# EAGLE board motor_board_tmc (EAGLE 9.6.2)
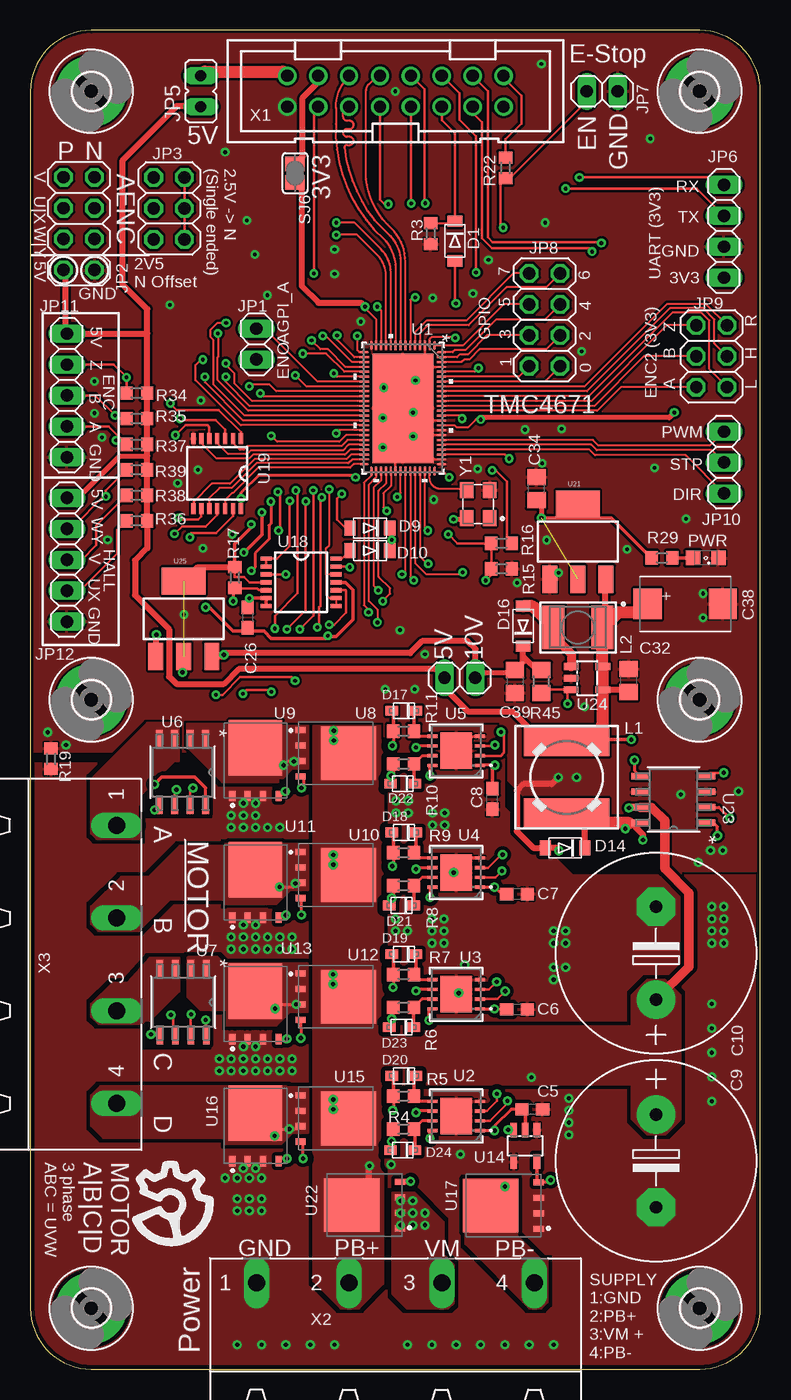
[diagram p3: board, top side]
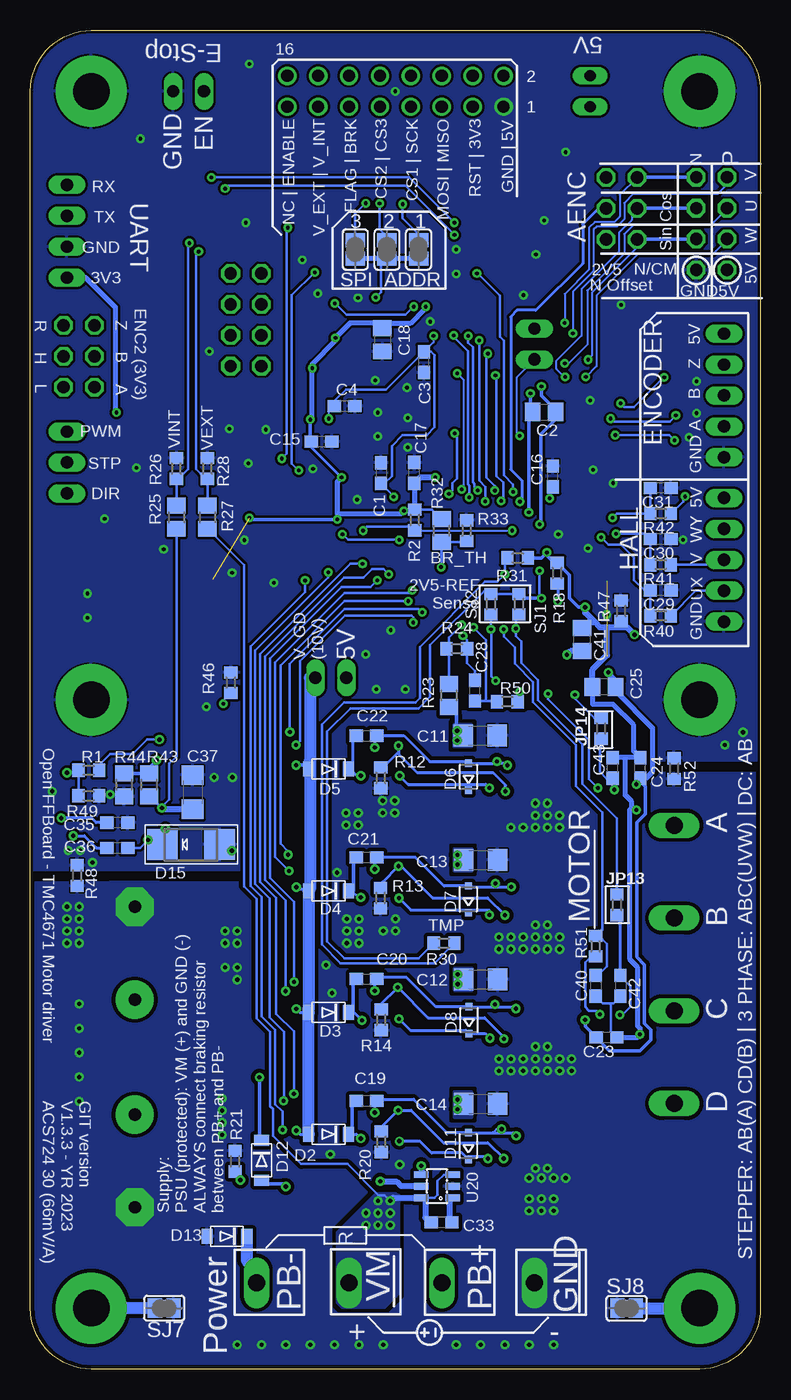
[diagram p4: board, bottom side, seen from below]

Size 60 x 110 mm. Coordinates in mm from the lower left corner, seen from the top.
Outline: 0,5 arc90 5,0 55,0 arc90 60,5 60,105 arc90 55,110 5,110 arc90 0,105 0,5
Copper layers (1*16): Top 0.07mm / dielectric 1.5mm / Bottom 0.07mm
Design rules "jlcpcb *": minimum track width 5mil, minimum drill 0.3mm, track to track 8mil, track to pad 8mil, pad to pad 8mil, via to via 8mil, smd to smd 5mil, copper to edge 0.2mm, drill to drill 8mil, minimum pad ring 10mil, minimum via ring 8mil, stop-mask expansion 4mil, vias tented up to drill 0.4mm, thermal gap 6mil

## Footprints (pad centres in the part's own frame; a part is rotated, then mirrored left to right if it is on the bottom)
C0603 = smd 1.1 x 1: 1 -0.85,0; 2 0.85,0
C0805 = smd 1.3 x 1.5: 1 -0.95,0; 2 0.95,0
E7,5-16 = drill 1.016 pad 3.15: + -3.81,0 | drill 1.016 pad 3.15 octagon: - 3.81,0
C1206 = smd 1.6 x 1.8: 1 -1.4,0; 2 1.4,0
CAPPM7343X310N = smd 2.31 x 2.52: 1 -3.1,0; 2 3.1,0
SOD-123FL = smd 0.91 x 1.22: A 1.637,0; C -1.637,0
SOD323-R = smd 0.6 x 0.6: A 1.1,0; C -1.1,0
SMADIODE = smd 2.54 x 2.54: A 2.349,0; C -2.349,0
SOD-323F = smd 1 x 0.8: A -1,0; C 1,0
3,0-PAD = drill 3 pad 5.842: B3,0 0,0
1X02 = drill 1.016 long: 1 -1.27,0; 2 1.27,0
2X04 = drill 1.016 octagon: 1 -3.81,-1.27; 2 -3.81,1.27; 3 -1.27,-1.27; 4 -1.27,1.27; 5 1.27,-1.27; 6 1.27,1.27; 7 3.81,-1.27; 8 3.81,1.27
2X03 = drill 1.016 octagon: 1 -2.54,-1.27; 2 -2.54,1.27; 3 0,-1.27; 4 0,1.27; 5 2.54,-1.27; 6 2.54,1.27
JP1 = drill 0.914 long: 1 0,-1.27; 2 0,1.27
1X04 = drill 1.016 long: 1 -3.81,0; 2 -1.27,0; 3 1.27,0; 4 3.81,0
1X03 = drill 1.016 long: 1 -2.54,0; 2 0,0; 3 2.54,0
1X05 = drill 1.016 long: 1 -5.08,0; 2 -2.54,0; 3 0,0; 4 2.54,0; 5 5.08,0
RESISTOR_R0603 = smd 1 x 1.1: 1 -0.85,0; 2 0.85,0
8MMINDUCTOR = smd 2.5 x 7: 1 -3,0; 2 3,0
L4532P = smd 1.8 x 3.6: 1 -2,0; 2 2,0
SML0805 = smd 1.2 x 1.2: A 1.05,0; C -1.05,0
R0603 = smd 1 x 1.1: 1 -0.85,0; 2 0.85,0
R0805 = smd 1.3 x 1.5: 1 -0.95,0; 2 0.95,0
SJ = smd 1.168 x 1.6: 1 -0.762,0; 2 0.762,0
QFN76_10P5X6P5 = smd 0.152 x 0.755: 1 -2.6,-5.173; 2 -2.2,-5.173; 3 -1.8,-5.173; 4 -1.4,-5.173; 5 -1,-5.173; 6 -0.6,-5.173; 7 -0.2,-5.173; 8 0.2,-5.173; 9 0.6,-5.173; 10 1,-5.173; 11 1.4,-5.173; 12 1.8,-5.173; 13 2.2,-5.173; 14 2.6,-5.173; 39 2.6,5.173; 40 2.2,5.173; 41 1.8,5.173; 42 1.4,5.173; 43 1,5.173; 44 0.6,5.173; 45 0.2,5.173; 46 -0.2,5.173; 47 -0.6,5.173; 48 -1,5.173; 49 -1.4,5.173; 50 -1.8,5.173; 51 -2.2,5.173; 52 -2.6,5.173 | smd 0.755 x 0.152: 15 3.179,-4.6; 16 3.179,-4.2; 17 3.179,-3.8; 18 3.179,-3.4; 19 3.179,-3; 20 3.179,-2.6; 21 3.179,-2.2; 22 3.179,-1.8; 23 3.179,-1.4; 24 3.179,-1; 25 3.179,-0.6; 26 3.179,-0.2; 27 3.179,0.2; 28 3.179,0.6; 29 3.179,1; 30 3.179,1.4; 31 3.179,1.8; 32 3.179,2.2; 33 3.179,2.6; 34 3.179,3; 35 3.179,3.4; 36 3.179,3.8; 37 3.179,4.2; 38 3.179,4.6; 53 -3.179,4.6; 54 -3.179,4.2; 55 -3.179,3.8; 56 -3.179,3.4; 57 -3.179,3; 58 -3.179,2.6; 59 -3.179,2.2; 60 -3.179,1.8; 61 -3.179,1.4; 62 -3.179,1; 63 -3.179,0.6; 64 -3.179,0.2; 65 -3.179,-0.2; 66 -3.179,-0.6; 67 -3.179,-1; 68 -3.179,-1.4; 69 -3.179,-1.8; 70 -3.179,-2.2; 71 -3.179,-2.6; 72 -3.179,-3; 73 -3.179,-3.4; 74 -3.179,-3.8; 75 -3.179,-4.2; 76 -3.179,-4.6 | smd 5.004 x 8.992: 77 0,0
SDC08A = smd 0.254 x 0.813: 1 -1.2,-1.943; 2 -0.4,-1.943; 3 0.4,-1.943; 4 1.2,-1.943; 5 1.2,1.943; 6 0.4,1.943; 7 -0.4,1.943; 8 -1.2,1.943 | smd 2.997 x 2.591: 9 0,0
SOIC8_D_TEX = smd 1.46 x 0.559: 1 -2.724,1.905; 2 -2.724,0.635; 3 -2.724,-0.635; 4 -2.724,-1.905; 5 2.724,-1.905; 6 2.724,-0.635; 7 2.724,0.635; 8 2.724,1.905
MOSFET_BSC093N04LSGATMA1 = smd 0.5 x 0.85: 1 -1.905,-2.9; 2 -0.635,-2.9; 3 0.635,-2.9; 4 1.905,-2.9 | smd 4.41 x 4.55: 5 0,1.05
SOT23-5L = smd 0.55 x 1.2: 1 -0.95,-1.3; 2 0,-1.3; 3 0.95,-1.3; 4 0.95,1.3; 5 -0.95,1.3
TSSOP14 = smd 0.9 x 0.35: 1 -2.875,1.95; 2 -2.875,1.3; 3 -2.875,0.65; 4 -2.875,0; 5 -2.875,-0.65; 6 -2.875,-1.3; 7 -2.875,-1.95; 8 2.875,-1.95; 9 2.875,-1.3; 10 2.875,-0.65; 11 2.875,0; 12 2.875,0.65; 13 2.875,1.3; 14 2.875,1.95
SOT23-6 = smd 0.55 x 1.2: 1 -0.95,-1.3; 2 0,-1.3; 3 0.95,-1.3; 4 0.95,1.3; 5 0,1.3; 6 -0.95,1.3
SOT223 = smd 1.219 x 2.235: 1 -2.311,-3.099; 2 0,-3.099; 3 2.311,-3.099 | smd 3.6 x 2.2: 4 0,3.099
21-0041B_8_MXM = smd 0.543 x 1.455: 1 -1.905,-2.721; 2 -0.635,-2.721; 3 0.635,-2.721; 4 1.905,-2.721; 5 1.905,2.721; 6 0.635,2.721; 7 -0.635,2.721; 8 -1.905,2.721
PAK100/2500-16 = drill 1 pad 1.422: 1 -8.89,-1.27; 2 -8.89,1.27; 3 -6.35,-1.27; 4 -6.35,1.27; 5 -3.81,-1.27; 6 -3.81,1.27; 7 -1.27,-1.27; 8 -1.27,1.27; 9 1.27,-1.27; 10 1.27,1.27; 11 3.81,-1.27; 12 3.81,1.27; 13 6.35,-1.27; 14 6.35,1.27; 15 8.89,-1.27; 16 8.89,1.27
GMSTBA4 = drill 1.397 long: 1 -11.43,5.08; 2 -3.81,5.08; 3 3.81,5.08; 4 11.43,5.08
ECS-327KE-TR = smd 1.3 x 1.1: 1 -1.15,-0.95; 2 1.15,-0.95; 3 1.15,0.95; 4 -1.15,0.95

## Placement (x,y rotation side)
C1  100nF  [C0603]  31.18,73.62 270 bottom
C2  10µF  [C0805]  17.77,78.65 0 bottom
C3  100nF  [C0603]  27.65,82.75 90 bottom
C4  100nF  [C0603]  34.17,79.12 180 bottom
C5  100nF  [C0603]  41.25,21.35 180 top
C6  100nF  [C0603]  40,29.55 180 top
C7  100nF  [C0603]  40,39.03 180 top
C8  100nF  [C0603]  37.98,46.85 90 top
C9  680µF  [E7,5-16]  51.42,17.1 270 top
C10  680µF  [E7,5-16]  51.42,34.17 90 top
C11  1µF  [C1206]  23.02,52.05 0 bottom
C12  1µF  [C1206]  22.98,32.03 0 bottom
C13  1µF  [C1206]  23,41.85 0 bottom
C14  1µF  [C1206]  23,21.8 0 bottom
C15  100nF  [C0603]  36.08,76.22 0 bottom
C16  100nF  [C0603]  17.05,73.35 90 bottom
C17  100nF  [C0603]  28.45,73.65 90 bottom
C18  10µF  [C0805]  31.07,84.58 270 bottom
C19  100nF  [C0603]  32.38,22.05 0 bottom
C20  100nF  [C0603]  32.38,32.05 0 bottom
C21  100nF  [C0603]  32.38,42.05 0 bottom
C22  100nF  [C0603]  32.38,52.05 0 bottom
C23  100nF  [C0603]  12.65,27.25 180 bottom
C24  100nF  [C0603]  9.88,49.4 90 bottom
C25  10µF  [C0805]  12.85,56.05 180 bottom
C26  100nF  [C0603]  17.85,61.75 270 top
C28  4.7nF  [C0603]  23.45,55.75 90 bottom
C29  4.7nF  [C0603]  8.2,64 180 bottom
C30  4.7nF  [C0603]  8.2,68.2 180 bottom
C31  4.7nF  [C0603]  8.2,72.4 180 bottom
C32  10µF  [C0805]  49.17,56.58 90 top
C33  100nF  [C0603]  26.2,12.05 180 bottom
C34  10µF  [C0805]  41.6,72.35 90 top
C35  100nF  [C0603]  52.85,44.9 180 bottom
C36  100nF  [C0603]  52.85,42.83 0 bottom
C37  1µF  [C1206]  46.67,47.4 270 bottom
C38  593D476X0016D2TE3  [CAPPM7343X310N]  53.83,62.88 0 top
C39  10µF  [C0805]  39.83,56.5 270 top
C40  4.7nF  [C0603]  13.55,31.5 270 bottom
C41  10µF  [C0805]  14.65,59.95 90 bottom
C42  100nF  [C0603]  11.5,31.5 270 bottom
C43  100nF  [C0603]  12.15,49.4 90 bottom
D1  LV low drop  [SOD-123FL]  34.9,92.7 270 top
D2  HV >100V  [SOD-123FL]  35.5,19.3 180 bottom
D3  HV >100V  [SOD-123FL]  35.5,29.3 180 bottom
D4  HV >100V  [SOD-123FL]  35.5,39.3 180 bottom
D5  HV >100V  [SOD-123FL]  35.5,49.3 180 bottom
D6  BZX384-XXX  [SOD323-R]  24,48.67 90 bottom
D7  BZX384-XXX  [SOD323-R]  24,38.6 90 bottom
D8  BZX384-XXX  [SOD323-R]  23.95,28.67 90 bottom
D9  LV low drop  [SOD-123FL]  27.9,69.1 180 top
D10  LV low drop  [SOD-123FL]  27.9,67.25 180 top
D11  BZX384-XXX  [SOD323-R]  24,18.33 90 bottom
D12  HV >100V  [SOD-123FL]  41,17.15 270 bottom
D13  Zener 65V (MMSZ5265BT1G)  [SOD-123FL]  43.85,10.9 180 bottom
D14  HV >100V  [SOD-123FL]  43.95,42.83 180 top
D15  HV >100V  [SMADIODE]  46.8,43.1 0 bottom
D16  LV low drop  [SOD-123FL]  40.5,61.05 90 top
D17  [SOD-323F]  30.7,54.1 0 top
D18  [SOD-323F]  30.7,44.1 0 top
D19  [SOD-323F]  30.7,34.1 0 top
D20  [SOD-323F]  30.7,24.1 0 top
D21  [SOD-323F]  30.5,38.1 0 top
D22  [SOD-323F]  30.6,48.1 0 top
D23  [SOD-323F]  30.5,28.1 0 top
D24  [SOD-323F]  30.6,18 0 top
H1  MOUNT-PAD-ROUND3.0  [3,0-PAD]  55,5 0 top
H2  MOUNT-PAD-ROUND3.0  [3,0-PAD]  5,5 0 top
H3  MOUNT-PAD-ROUND3.0  [3,0-PAD]  55,105 0 top
H4  MOUNT-PAD-ROUND3.0  [3,0-PAD]  55,55 0 top
H5  MOUNT-PAD-ROUND3.0  [3,0-PAD]  5,105 0 top
H6  MOUNT-PAD-ROUND3.0  [3,0-PAD]  5,55 0 top
JP1  [1X02]  18.57,84.22 90 top
JP2  [2X04]  4,94.12 90 top
JP3  [2X03]  11.4,95.38 270 top
JP4  V_DRV  [1X02]  35.3,56.8 180 top
JP5  [JP1]  14,105 0 top
JP6  [1X04]  57,93.5 270 top
JP7  [1X02]  47,105 180 top
JP8  [2X04]  42.27,86.22 90 top
JP9  [2X03]  56,83.22 90 top
JP10  [1X03]  57,74.5 270 top
JP11  [1X05]  3,80 270 top
JP12  [1X05]  3,66.5 270 top
JP13  JUMPER-SMT_2_NO_SILK  [RESISTOR_R0603]  11.8,38.15 90 bottom
JP14  JUMPER-SMT_2_NO_SILK  [RESISTOR_R0603]  13.1,52.65 90 bottom
L1  220µH  [8MMINDUCTOR]  44.08,48.62 90 top
L2  10µH  [L4532P]  45,60.95 180 top
LED1  Green  [SML0805]  55.5,66.65 180 top
R1  47k  [R0603]  55.2,49.2 0 bottom
R2  10k  [R0603]  28.4,69.78 90 bottom
R3  10k  [R0603]  32.9,93.3 90 top
R4  10  [R0603]  30.68,19.72 0 top
R5  10  [R0603]  30.68,22.42 0 top
R6  10  [R0603]  30.68,29.72 0 top
R7  10  [R0603]  30.68,32.42 0 top
R8  10  [R0603]  30.68,39.72 0 top
R9  10  [R0603]  30.68,42.42 0 top
R10  10  [R0603]  30.68,49.73 0 top
R11  10  [R0603]  30.68,52.42 0 top
R12  36k  [R0603]  31.2,48.58 90 bottom
R13  36k  [R0603]  31.23,38.7 90 bottom
R14  36k  [R0603]  31.18,28.7 90 bottom
R15  10k  [R0603]  38.73,65.75 180 top
R16  1.5k  [R0603]  38.73,67.85 180 top
R17  10k  [R0603]  16.8,65.05 90 top
R18  10k  [R0603]  16.7,65.4 270 bottom
R19  0  [R0603]  1.7,50.15 270 top
R20  36k  [R0603]  31.15,18.67 90 bottom
R21  36k  [R0603]  43.17,17.08 270 bottom
R22  1.5k  [R0603]  39.05,98.7 90 top
R23  71.5k  [R0805]  25.6,55.35 270 bottom
R24  1.5k  [R0603]  24.95,59.2 180 bottom
R25  294k  [R0805]  48,70 270 bottom
R26  10k  [R0603]  48,74 270 bottom
R27  294k  [R0805]  45.45,70 270 bottom
R28  10k  [R0603]  45.45,74 270 bottom
R29  1.5k  [R0603]  51.9,66.65 180 top
R30  10k thermistor  [R0603]  26,35 180 bottom
R31  1.5k  [R0603]  19.95,66.65 180 bottom
R32  71.5k  [R0805]  26.2,68.9 90 bottom
R33  47k  [R0603]  24.15,68.9 270 bottom
R34  4.7k  [R0603]  8.75,80.2 0 top
R35  4.7k  [R0603]  8.75,78.1 0 top
R36  4.7k  [R0603]  8.75,69.7 0 top
R37  4.7k  [R0603]  8.75,76 0 top
R38  4.7k  [R0603]  8.75,71.8 0 top
R39  4.7k  [R0603]  8.75,73.9 0 top
R40  1.5k  [R0603]  8.2,61.9 0 bottom
R41  1.5k  [R0603]  8.2,66.1 0 bottom
R42  1.5k  [R0603]  8.2,70.3 0 bottom
R43  294k  [R0805]  50.25,48 270 bottom
R44  71.5k  [R0805]  52.3,48 270 bottom
R45  71.5k  [R0805]  42,56.5 90 top
R46  10k  [R0603]  43.52,56.4 270 bottom
R47  0  [R0603]  11.45,62.3 90 bottom
R48  0  [R0603]  56.15,40.55 270 bottom
R49  15k  [R0603]  55.2,47.1 180 bottom
R50  1.5k  [R0603]  20.8,54.85 0 bottom
R51  1.5k  [R0603]  13.55,34.75 270 bottom
R52  0  [R0603]  7.1,49.35 270 bottom
SJ1  0R  [RESISTOR_R0603]  22.15,62.85 270 bottom
SJ2  0R  [RESISTOR_R0603]  19.85,62.85 270 bottom
SJ3  [SJ]  28.1,92 270 bottom
SJ4  [SJ]  30.7,92 270 bottom
SJ5  [SJ]  33.3,92 270 bottom
SJ6  3.3V  [SJ]  21.75,98.28 270 top
SJ7  [SJ]  49,5 180 bottom
SJ8  [SJ]  11,5 0 bottom
U1  TMC4671  [QFN76_10P5X6P5]  30.62,78.95 180 top
U2  LM5109BSD  [SDC08A]  35,20.8 90 top
U3  LM5109BSD  [SDC08A]  35,30.8 90 top
U4  LM5109BSD  [SDC08A]  35,40.8 90 top
U5  LM5109BSD  [SDC08A]  35,50.8 90 top
U6  TMCS1100  [SOIC8_D_TEX]  12.5,49.05 270 top
U7  TMCS1100  [SOIC8_D_TEX]  12.55,30.15 270 top
U8  BSC030N08NS5ATMA1  [MOSFET_BSC093N04LSGATMA1]  25.1,50.6 270 top
U9  BSC030N08NS5ATMA1  [MOSFET_BSC093N04LSGATMA1]  18.5,50 0 top
U10  BSC030N08NS5ATMA1  [MOSFET_BSC093N04LSGATMA1]  25.1,40.6 270 top
U11  BSC030N08NS5ATMA1  [MOSFET_BSC093N04LSGATMA1]  18.5,40 0 top
U12  BSC030N08NS5ATMA1  [MOSFET_BSC093N04LSGATMA1]  25.1,30.6 270 top
U13  BSC030N08NS5ATMA1  [MOSFET_BSC093N04LSGATMA1]  18.5,30 0 top
U14  MCP14XX  [SOT23-5L]  40.67,18.35 180 top
U15  BSC030N08NS5ATMA1  [MOSFET_BSC093N04LSGATMA1]  25.1,20.6 270 top
U16  BSC030N08NS5ATMA1  [MOSFET_BSC093N04LSGATMA1]  18.5,20 0 top
U17  BSC030N08NS5ATMA1  [MOSFET_BSC093N04LSGATMA1]  38.88,13.42 90 top
U18  MCP6004  [TSSOP14]  22.25,64.65 0 top
U19  74LV17APWJ  [TSSOP14]  15.35,73.6 270 top
U20  LM74700-Q1  [SOT23-6]  26.57,15.03 90 bottom
U21  [SOT223]  45,68 0 top
U22  BSC030N08NS5ATMA1  [MOSFET_BSC093N04LSGATMA1]  27.48,13.47 90 top
U23  MAX5033BASA+T  [21-0041B_8_MXM]  52.85,46.8 90 top
U24  AP3012KTR-G1  [SOT23-5L]  45.75,56.77 270 top
U25  [SOT223]  12.6,61.65 0 top
X1  2516-  [PAK100/2500-16]  30,105 0 top
X2  GMSTBA4  [GMSTBA4]  30,2 0 top
X3  GMSTBA4  [GMSTBA4]  2,33.25 270 top
Y1  25MHz  [ECS-327KE-TR]  36.8,71.08 90 top

## Tracks (layer width: path | path; a pad name or v marks a point on that pad's centre or on a via)
2.5V_REF  (via drill 0.3)
  Top 0.2: JP3.2 JP3.4 JP3.6
  Top 0.254: v18.15,65.6 18.47,65.92 18.47,67.05 19.62,68.19 19.62,69.33 19.77,69.48 v19.77,71.28
  Top 0.3: C26.1 17.85,63.2 v18,63.35
  Top 0.305: U18.7 U18.6 v18,63.35
  Bottom 0.2: 19.85,63.35 SJ2.1 SJ1.1 22.36,63.91 22.72,63.91 27.15,59.48 27.15,55.25 28.1,54.3 33.7,54.3 35.6,52.4 35.6,35.15 34.2,33.75 28.1,33.75 R30.2 | v18.15,65.6 18.15,63.5 v18,63.35
  Bottom 0.254: JP3.4 12.82,95.53 13.16,95.53 14.61,94.08 14.61,90.85 18.46,87 20,87 20.52,86.48 20.52,73.92 19.62,73.01 19.62,71.43 v19.77,71.28
  Bottom 0.305: 19.85,63.35 v18,63.35
2.5V_REF_A  (via drill 0.3)
  Top 0.152: U1.17 26.44,82.75 24.29,84.9 v24.02,84.9
  Top 0.2: v23.24,72.2 23.29,72.15 23.29,61.94 v22.15,60.8 | v15.25,55.4 15.79,55.4 17.25,56.86 21.45,56.86 v21.75,56.56
  Bottom 0.2: v24.02,84.9 24.02,84.34 23.64,83.96 23.64,72.89 23.49,72.74 23.49,72.46 v23.24,72.2 | SJ1.2 v22.15,60.8 22.09,60.74 22.09,56.9 v21.75,56.56 | v15.25,55.4 15.25,55.1 13.65,53.5 JP14.2
2.5V_REF_C  (via drill 0.3)
  Top 0.152: U1.19 25.8,81.95 24.3,83.44 v22.4,83.44
  Top 0.2: v21.82,72.19 21.97,72.05 21.97,63.77 20.1,61.9 v20.1,60.85
  Bottom 0.2: v22.4,83.44 22.54,83.31 22.54,73.25 21.82,72.54 v21.82,72.19 | SJ2.2 20.1,61.75 v20.1,60.85 20.1,60.25 19.65,59.8 19.65,58 18.27,56.62 18.27,54.98 14.63,51.34 14.63,48.07 11.8,45.24 JP13.2
2.5V_REF_RAW  (via drill 0.35)
  Top 0.2: R17.1 16.85,64.15 18.62,64.15 18.77,64 U18.5
  Top 0.25: R17.1 16.65,64.05 v16.65,63.1
  Bottom 0.25: R18.2 16.65,64.5 v16.65,63.1
5V_SENSE  (via drill 0.3, 0.35)  (1 unrouted)
  Top 0.152: U1.23 20.2,80.35 19.65,80.9 18.15,80.9 v18,80.75
  Top 0.2: U18.4 18.02,64.65 17.57,65.1 16.8,65.1 R17.2 16.7,65.8
  Top 0.254: 14.4,47.75 14.4,47.74 U6.8 | v14.4,28.7 14.46,28.64 U7.8
  Top 0.3: 14.4,47.75 13.5,48.65 10.8,48.65 v10.2,48.05 | 13.25,64.75 U25.4 | R17.2 16.8,67.8 18.14,69.15 v18.14,69.41
  Top 0.5: U25.2 12.5,58.45 v12.5,57.25 | U25.4 13.75,65.9 R17.2
  Bottom 0.2: v18.14,69.41 18.03,69.29 | v10.2,48.05 10.2,48.23 C24.1
  Bottom 0.3: v14.4,28.7 14.4,28.15 C23.2 12.4,26.15 9.9,26.15 9,27.05 9,27.88 9.53,28.41 9.53,33.23 10.17,33.87 10.17,44.92 9.47,45.62 9.47,47.88 9.88,48.29 C24.1 | v18,80.75 18,79.97 16.82,78.8 C2.2 16.82,78.05 18.03,76.85 18.03,69.29
  Bottom 0.4: C24.1 9.43,48.55 8.85,49.12 8.85,52.65 11.9,55.7 C25.1 11.45,56.5
  Bottom 0.5: v12.5,57.25 12.5,57.1 11.9,56.5 C25.1
+3V3  (via drill 0.3)  (1 unrouted)
  Top 0.152: U1.52 33.25,73.75 33.95,73.75 v34.42,73.28 | U1.43 29.62,72.58 29.02,71.98 29.02,70.81 v29.3,70.53 | U1.13 28.42,86.28 27.5,87.19 v27.5,87.3 | v34.92,84.75 34.92,84.8 33,84.8 32.82,84.62 U1.2 | v36.83,82.25 36.52,81.95 U1.72 | v37,78.03 36.6,78.03 35.99,77.42 35,77.42 34.87,77.55 U1.61
  Top 0.2: v17.32,71.56 17.32,70.75 U19.14
  Top 0.254: v26.73,73.28 26.57,73.42 18.74,73.42 17.32,72 v17.32,71.56
  Top 0.3: v42,69.95 45,69.95 | R29.2 47.75,69.95 45,69.95 | U21.4 45,69.95
  Top 0.4: Y1.4 35.75,69.83 v34.77,69.83 | v52.92,78.6 52.5,78.17 37.15,78.17 v37,78.03 | C34.1 42,71 v42,69.95
  Top 0.5: v27.5,87.3 27.18,87.62 23.68,87.62 22.3,89 22.3,96.96 SJ6.2
  Bottom 0.2: v29.3,70.53 29.2,70.62 R2.2 26.98,70.62 R32.2 | C15.1 37,76.3 | v17.32,71.56 17.32,72.23 C16.1
  Bottom 0.254: v34.42,73.28 36.92,75.78 C15.1
  Bottom 0.3: v27.5,87.3 27.6,87.2 | 36.91,78.12 v37,78.03 37,76.3 | v42,69.95 41.88,69.83 v34.77,69.83
  Bottom 0.4: 34.77,70.28 v34.77,69.83 | 27.6,87.2 27.6,87.1 28.77,85.92 31.07,85.92 | 36.91,78.12 36.91,82.17 v36.83,82.25 36.83,82.6 34.92,84.5 v34.92,84.75 33.73,85.95 31.07,85.95 31.07,85.92 | C17.1 28.45,71 28.93,70.53 v29.3,70.53 29.55,70.28 34.77,70.28 | v52.92,78.6 53,78.67 53,87.22 55.47,89.69 JP6.4 | C18.1 31.07,85.92 | 34.77,70.28 34.77,72.92 v34.42,73.28
  Bottom 0.5: v26.73,73.28 27.98,73.28 C17.1
+5V  (via drill 0.35)
  Top 0.2: 47.21,61.16 L2.1
  Top 0.254: C38.1 50.02,62.17 50,62.17
  Top 0.3: v49.4,51.73 46.73,51.73 46.62,51.62
  Top 0.4: JP12.1 3.88,71.58 7.33,75.03 9.6,75.03
  Top 0.5: 9.6,85.1 9.58,85.08 JP11.1 2.88,85.2 2.88,90.17 JP2.2 | 9.6,85.1 R34.2 R35.2 R37.2 9.6,75.03 R39.2 R38.2 R36.2 9.6,67.45 8.6,66.45 8.6,63.6 11.4,60.8 11.4,56.9 12,56.3 15.9,56.3 17.11,57.51 33.32,57.51 JP4.2 34.33,56.5 34.33,55.67 35.95,54.05 39.6,54.05 42.02,51.62 L1.2 45.62,51.62 47,53 | 9.6,85.1 9.6,87.1 7.6,89.1 7.6,99.35 12.03,103.78 13.95,103.78 JP5.1 | 47,55.77 U24.4 48.98,55.83 C32.1 | 47,52 46.62,51.62 | U21.3 47.21,64.8 47.21,61.16
  Top 0.8: U24.5 47,57.77
  Top 1: C38.1 51.26,63.41 | U24.4 U24.5 | 47,55.77 47,53 47,52 | 47,57.77 L2.1 47.1,60.95 48.33,62.17 50,62.17 51,62.17 51,63
  Bottom 0.2: v49.4,51.73 50.4,51.73 51.58,50.55 53.45,50.55 54.2,49.8 54.2,49.35 R1.2
AENC_UX  (via drill 0.3)
  Top 0.15: 18.2,79.55 16.75,81 16.75,81.83 16.07,82.5 v16.07,82.65
  Top 0.152: U1.25 18.2,79.55
  Bottom 0.15: 14.22,88.62 14.22,84.17 15.75,82.65 v16.07,82.65
  Bottom 0.152: 10.41,94.05 11.19,93.27 11.19,91.66 14.22,88.62 | JP2.6 2.73,95.34
  Bottom 0.2: 10.41,94.05 4.02,94.05 2.73,95.34
AENC_UX_N  (via drill 0.3)
  Top 0.15: U1.26 18.02,79.15 16.05,81.12 v16.05,81.53
  Bottom 0.152: v16.05,81.53 16.1,81.53 16.75,82.17 16.75,82.87 14.7,84.92 14.7,88.72 11.61,91.81 11.61,93.39 10.58,94.43 10.58,94.93 JP3.3 10.11,95.39
  Bottom 0.3: JP2.5 10.11,95.39
AENC_VN  (via drill 0.3)
  Top 0.15: U1.27 17.91,78.75
  Top 0.152: 17.91,78.75 15.39,81.27 15.39,83.14 15.41,83.16 v15.41,85.11
  Bottom 0.152: 10.43,96.6 11.2,95.83 11.2,94.47 11.78,93.89 13.46,93.89 13.72,93.62 13.72,90.2 15.41,88.52 v15.41,85.11
  Bottom 0.2: 2.72,97.38 3.5,96.6 10.43,96.6 | JP2.8 2.72,97.92
  Bottom 0.3: 2.72,97.92 2.72,97.38
AENC_VN_N  (via drill 0.3)
  Top 0.15: U1.28 17.62,78.35 15.04,80.94
  Top 0.152: v16.08,85.96 15.36,85.96 14.78,85.37 14.78,84.84 15.04,84.58 15.04,80.94
  Bottom 0.152: v16.08,85.96 16.08,88.35 14.08,90.35 14.08,93.77 13.61,94.25 12.01,94.25 11.56,94.7 11.56,96.49 JP3.1 10.11,97.94
  Bottom 0.3: JP2.7 10.11,97.94
AENC_WY  (via drill 0.3)
  Top 0.15: U1.29 17.48,77.95 14.35,81.08 v14.35,81.53
  Bottom 0.152: 10.03,91.67 13.47,88.22 13.47,82.4 v14.35,81.53 | JP2.4 2.73,92.8
  Bottom 0.2: 10.03,91.67 3.85,91.67 2.73,92.8
AENC_WY_N  (via drill 0.3)
  Top 0.15: U1.30 17.28,77.55 13.57,81.26 13.57,82.5
  Top 0.152: 13.57,82.5 14.03,82.95 v14.17,82.95
  Bottom 0.152: v14.17,82.95 13.83,83.29 13.83,88.47 10.13,92.17 JP3.5 10.11,92.86
  Bottom 0.3: JP2.3 10.11,92.86
AGPI_A
  Top 0.152: U1.21 23.6,81.15 19.25,85.5 JP1.2
AGPI_B  (via drill 0.3)
  Top 0.152: U1.22 22.68,80.75 v21.78,81.65
  Top 0.2: U18.2 U18.1 20.27,66.6 21.32,67.64 v21.32,71.35
  Bottom 0.2: v21.78,81.65 21.68,81.55 21.68,73.4 21.12,72.84 21.12,71.55 v21.32,71.35
BRAKE_CTRL  (via drill 0.3, 0.35)
  Top 0.2: D10.C 29.69,67.4 v29.69,68.15 29.69,69.12 29.56,69.12 D9.C | v34.35,68.6 35.1,67.85 R16.2 R15.2 37.88,65.25 v37.42,64.8
  Top 0.254: U14.3 v39.27,19.65
  Bottom 0.2: v37.42,64.8 37.42,63.85 41.92,59.36 41.92,39.71 41,38.79 41,29 39.88,27.88 39.88,21.77 39.27,21.16 v39.27,19.65 | v34.35,68.6 33.9,68.15 v29.69,68.15
BRAKE_CTRL_EXT  (via drill 0.3)
  Top 0.2: X1.12 35.25,104.83 35.25,102.65 36.6,101.3 36.6,90.15 v36.62,90.12 | R16.1 39.17,68.25 39.17,72.92 38.25,73.85 v37.95,73.85
  Bottom 0.2: v36.62,90.12 38.52,88.23 38.52,74.42 v37.95,73.85
BRAKE_CTRL_TMC  (via drill 0.3)
  Top 0.152: U1.31 25.38,77.15 v25.12,76.9
  Top 0.2: v25.6,71.92 25.2,71.53 25.2,69.8 25.9,69.1 D9.A
  Bottom 0.2: v25.12,76.9 24.95,76.72 24.95,73.17 25.3,72.83 25.3,72.22 v25.6,71.92
BRAKE_GATE  (via drill 0.35)
  Top 0.254: v42.75,15.53 42.55,15.33 U17.4
  Top 0.3: U17.4 41.65,15.45 41.65,17.03 U14.5
  Bottom 0.2: R21.2 42.75,16.22 v42.75,15.53
BRAKE_RES_COMP
  Top 0.152: D10.A 25.61,66.6 U18.14
BRAKE_RES_TH  (via drill 0.3)
  Top 0.2: U18.13 26.2,65.95 v26.25,65.9
  Bottom 0.2: R33.2 24.25,67.95 R32.1 26.2,65.95 v26.25,65.9
C_HS_A  (via drill 0.3, 0.35)
  Top 0.152: U1.39 28.02,73.43 27.42,72.83 27.42,62.77 27.79,62.4 v27.79,62.2
  Top 0.2: U5.2 38.67,50.4 38.92,50.65 38.92,52.1 v38.67,52.35
  Bottom 0.2: v38.67,52.35 38.7,52.38 38.7,57.94 34.2,62.45 28.12,62.45 27.87,62.2 v27.79,62.2
C_HS_B  (via drill 0.3, 0.35)
  Top 0.152: U1.41 28.82,73.03 28.22,72.43 28.22,64.38 v28.6,64
  Top 0.2: U4.2 38.23,40.4 v38.75,40.92
  Bottom 0.2: v38.75,40.92 39.9,42.08 39.9,58.08 34.2,63.77 28.82,63.77 v28.6,64
C_HS_C  (via drill 0.3, 0.35)
  Top 0.152: U1.46 30.8,73.75 30.8,65.55 v30.55,65.3
  Top 0.2: U3.2 38.38,30.4 v39.02,31.05
  Bottom 0.2: v39.02,31.05 39.02,38.53 40.71,40.21 40.71,58.54 34.21,65.03 32.64,65.03 31.92,65.75 31,65.75 v30.55,65.3
C_HS_D  (via drill 0.3, 0.35)
  Top 0.152: v35.52,65.47 35.35,65.3 32.55,65.3 31.62,66.23 U1.48
  Top 0.2: U2.2 37.77,20.4 39.2,21.83 v39.2,22.05
  Bottom 0.2: v39.2,22.05 39.15,22.1 39.15,27.72 40.33,28.9 40.33,38.69 41.51,39.87 41.51,59.06 35.52,65.05 v35.52,65.47
C_LS_A  (via drill 0.3, 0.35)
  Top 0.152: U1.40 28.42,73.28 27.82,72.68 27.82,63.1 28.52,62.4 v28.52,61.35
  Top 0.2: U5.3 38.1,51.2 v38.17,51.27
  Bottom 0.2: v38.17,51.27 37.85,51.6 37.85,58.2 34.12,61.92 28.68,61.92 28.52,61.77 v28.52,61.35
C_LS_B  (via drill 0.3, 0.35)
  Top 0.152: U1.42 29.22,72.78 28.62,72.18 28.62,65.1 29.56,64.16 29.56,63.71 v28.95,63.11
  Top 0.2: U4.3 37.62,41.2 38.7,42.28 v38.83,42.28
  Bottom 0.2: v38.83,42.28 38.83,42.55 39.45,43.17 39.45,57.83 34.17,63.11 v28.95,63.11
C_LS_C  (via drill 0.3, 0.35)
  Top 0.152: U1.47 31.22,65.09 v31.5,64.81
  Top 0.2: U3.3 37.7,31.2 v38.33,31.83
  Bottom 0.2: v38.33,31.83 38.33,38.4 40.3,40.37 40.3,58.37 34.42,64.26 32.05,64.26 v31.5,64.81
C_LS_D  (via drill 0.3, 0.35)
  Top 0.152: U1.49 32,73.76 32,66.75 32.58,66.17 v32.7,66.17
  Top 0.2: v38.35,22.62 38.35,22.03 37.52,21.2 U2.3
  Bottom 0.2: v38.35,22.62 38.35,27.75 39.8,29.2 39.8,38.73 41.11,40.04 41.11,58.77 33.7,66.17 v32.7,66.17
CLK_25M
  Top 0.152: Y1.3 35.75,72.33 33.7,72.33 arc-90 32.82,73.21 U1.51
CS1  (via drill 0.3)
  Top 0.2: X1.7 28.73,96.09 29.1,95.72 v29.4,95.72
  Bottom 0.2: SJ3.1 28.1,93.26 29.4,94.56 v29.4,95.72
CS2  (via drill 0.3)
  Top 0.2: X1.9 31.27,95.81 v31.3,95.78
  Bottom 0.2: v31.3,95.78 31.3,93.68 30.7,93.08 SJ4.1
CS3  (via drill 0.3)
  Top 0.2: X1.10 32.38,105.17 32.38,95.78 32.42,95.78 v32.45,95.8
  Bottom 0.2: SJ5.1 33.3,94.95 v32.45,95.8
CS_TMC  (via drill 0.3)
  Top 0.152: 31.43,88.08 31.22,87.87 U1.6
  Top 0.2: v31.62,88.08 31.43,88.08
  Bottom 0.2: v31.62,88.08 31.2,88.5 31.2,90.74 SJ4.2
  Bottom 0.4: SJ3.2 SJ4.2 SJ5.2
DIR
  Top 0.152: JP10.3 53.86,75.1 46.4,75.1 45.95,75.55 U1.56
ENABLE  (via drill 0.3)
  Top 0.152: 39.02,75.15 U1.55
  Top 0.2: v39.35,74.82 39.02,75.15 | v38.85,93.79 38.62,94.02 38.62,97.42 R22.1 39.4,97.85 45.73,104.18 JP7.2
  Bottom 0.2: v38.85,93.79 38.95,93.69 38.95,75.22 v39.35,74.82
ENC2_A
  Top 0.152: JP9.2 48.53,80.69 46.59,78.75 U1.64
ENC2_B
  Top 0.152: JP9.4 50.43,83.22 46.35,79.15 U1.65
ENC2_Z
  Top 0.152: JP9.6 52.33,85.77 46.12,79.55 U1.66
ENC_A
  Top 0.152: U1.35 26.26,75.55 25.85,75.14 18.29,75.14 17.98,74.83 15.31,74.83 14.05,76.09 U19.6
ENC_A_5V  (via drill 0.3)
  Top 0.152: v7.05,76.33 7.58,76.33 R37.1
  Top 0.2: R37.1 6.44,77.46 JP11.4 | U19.5 14.7,77.41 14.55,77.56 12.77,77.56 11.95,76.75 v11.93,76.75
  Bottom 0.2: v7.05,76.33 7.47,76.75 v11.93,76.75
ENC_B
  Top 0.152: U1.34 26.16,75.95 25.7,75.49 18.1,75.49 17.8,75.19 16.25,75.19 15.35,76.09 U19.4
ENC_B_5V  (via drill 0.3)
  Top 0.2: R35.1 7.22,78.1 v6.95,78.38 5.33,80 JP11.3 | U19.3 16,77.18 15.21,77.97 12.3,77.97 v12.3,78.1
  Bottom 0.2: v6.95,78.38 7.45,77.88 12.07,77.88 v12.3,78.1
ENC_Z
  Top 0.152: U1.33 26.05,76.35 25.55,75.85 17.83,75.85 17.52,75.55 17.2,75.55 16.65,76.09 U19.2
ENC_Z_5V  (via drill 0.3)
  Top 0.2: JP11.2 6.86,82.54 v7.9,81.5 R34.1 | U19.1 17.3,77 15.48,78.82 12.03,78.82 v11.5,79.35
  Bottom 0.2: v11.5,79.35 11.2,79.05 10.4,79.05 7.92,81.53 v7.9,81.5
ENO  (via drill 0.3)
  Top 0.152: U1.32 25.95,76.75 25.41,76.21 20.28,76.21 v19.79,76.7
  Bottom 0.152: JP1.1 20.05,81.48 20.05,76.96 v19.79,76.7
FLAG
  Top 0.152: R3.2 34.85,94.15 34.9,94.2 D1.C
  Top 0.2: X1.11 33.81,102.63 34.9,101.54 D1.C
G_HS_A  (via drill 0.35)
  Top 0.254: v22.27,47.75 22.48,47.75 22.48,48.42 U8.4 | R10.1 29.82,48.92 v29.65,48.75
  Top 0.3: D22.A 29.6,48.7 v29.65,48.75
  Bottom 0.2: D6.C 24,48.05
  Bottom 0.254: v22.27,47.75 22.57,48.05 24,48.05 28.95,48.05 v29.65,48.75
G_HS_B  (via drill 0.35)
  Top 0.254: v22.27,37.33 22.27,38.62 U10.4 | R8.1 29.82,38.83 v29.7,38.7
  Top 0.3: D21.A 29.5,38.5 v29.7,38.7
  Bottom 0.2: D7.C 24,37.72
  Bottom 0.254: 24,37.72 22.27,37.72 v22.27,37.33 | v29.7,38.7 28.73,37.72 24.23,37.72 D7.C
G_HS_C  (via drill 0.35)
  Top 0.254: U12.4 22.2,28.1 22.23,28.08 v22.23,27.2 | v29.7,28.78 29.82,28.9 R6.1
  Top 0.3: D23.A 29.5,28.58 v29.7,28.78
  Bottom 0.254: v22.23,27.2 22.6,27.58 D8.C 24.23,27.85 28.77,27.85 v29.7,28.78
G_HS_D  (via drill 0.35)
  Top 0.254: v22.4,17.3 22.4,18.5 U15.4 | v29.68,18.72 29.68,19.58 R4.1
  Top 0.3: D24.A 29.68,18.08 v29.68,18.72
  Bottom 0.2: D11.C 24,17.47
  Bottom 0.254: 24,17.47 22.45,17.47 22.4,17.42 v22.4,17.3 | D11.C 24.52,17.75 27.02,17.75 28,18.72 v29.68,18.72
G_LS_A  (via drill 0.35)
  Top 0.254: U9.4 20.57,47.1 v20.95,47.48 | R11.1 29.82,51.3 v29.75,51.23
  Top 0.3: D17.A 29.82,53.98 R11.1
  Bottom 0.152: R12.2 31.02,49.42 30.73,49.73
  Bottom 0.254: v20.95,47.48 20.95,47.98 21.97,49.01 28.21,49.01 29.75,50.55 | v29.75,51.23 29.75,50.55 | 29.75,50.55 29.82,50.62 30.73,49.73
G_LS_B  (via drill 0.35)
  Top 0.254: U11.4 20.8,37.1 v21,37.3 | R9.1 29.82,41.4 v29.75,41.33
  Top 0.3: D18.A 29.82,43.97 R9.1
  Bottom 0.152: R13.2 31.04,39.74 31.04,40.04
  Bottom 0.254: v21,37.3 22.43,38.72 26.95,38.72 29.55,41.33 v29.75,41.33 31.04,40.04
G_LS_C  (via drill 0.35)
  Top 0.254: U13.4 20.43,27.12 v21.07,27.12 | R7.1 29.82,31.39 v29.8,31.37
  Top 0.3: D19.A 29.82,33.97 R7.1
  Bottom 0.152: R14.2 31.18,29.99
  Bottom 0.254: v21.07,27.12 21.07,27.28 22.68,28.88 27.31,28.88 v29.8,31.37 31.18,29.99
G_LS_D  (via drill 0.35)
  Top 0.254: v21.1,17.3 20.61,17.3 U16.4 | R5.1 29.82,21.32 v29.77,21.27
  Top 0.3: D20.A 29.82,23.97 R5.1
  Bottom 0.152: R20.2 31.15,19.89
  Bottom 0.254: v21.1,17.3 22.4,18.6 26.05,18.6 28.72,21.27 v29.77,21.27 31.15,19.89
GND  (via drill 0.3, 0.35)
  Top 0.152: 30.62,80 30.62,81.87 31.1,82.35 32.5,82.35 | 30.62,80 U1.77 | 30.62,80 30.57,79.95 29,79.95 30,78.95 U1.77 | U1.54 33.25,74.75 31.5,76.5 | 31.42,76.75 31.59,76.59 31.5,76.5 | 31.42,76.75 30.62,77.55 30.62,78 | 30.62,78 U1.77 | U1.62 32.55,77.95 32.5,78 30.62,78 | U1.73 32.5,82.35 | U1.3 32.42,82.43 32.5,82.35 | U1.44 30.02,74.98 30,75 31.5,76.5 | U1.59 31.42,76.75
  Top 0.5: v43.4,48.62 42.85,48.08 40.54,48.08 39.97,47.51 39.97,44.19 41.33,42.83 D14.A 43.23,42.83 v43.45,42.6
  other vias: 16,100 30,105 25,92 36.38,88.38 42.3,94.2 42,107.25 25,90 29.05,80.65 50.95,101.1 11.45,87.45 36.77,73.97 51.3,74.05 17.77,94.4 13.75,73.9 45.3,83.62 31.65,81.25 28.98,78.17 31.45,78.6 28.98,75.75 31.45,76.65 33.15,71.45 27.15,86.08 5.25,81.15 5.25,78.55 6.35,68.15 5.88,76.58 18.45,91.6 12.1,72.8 19.48,88.25 14.18,67.45 37.65,91.15 49.05,67.35 45.55,54.42 40,64.6 43.65,77.25 40.65,77.2 16.6,68.6 44.9,48.62 53.9,69.88 55.3,63.73 14,79.6 30.38,60.73 12.62,62 33.08,88.03 53.45,47.23 55.9,42.62 54.9,41.62 56.9,42.62 1.43,52.33 2.92,51.27 43.42,65.42 42.08,74.42 55.3,61.73 58.2,47.48 29.18,55.88 31.57,55.88 42.42,68.12 32.42,58.73
  pour Bottom (rank 6): -0.45,50 -0.45,111 60.3,111 60.3,41 42.2,41 42.2,50
  pour Top (rank 6): -0.6,50.67 -0.6,111 60.3,111 60.3,40.25 47.35,40.25 36.9,50.7
  pour Top (no thermals): 22,105 20,105 20,102.65 22,102.65
  pour Bottom (no thermals): 22,105 20,105 20,102.65 22,102.65
  cutout Top: 9,45.35 14.85,45.35 14.85,48.5 11.25,48.5 9,46.25
GND1
  cutout Top: 9.2,26.35 14.75,26.35 14.75,28.45 9.5,28.45 9.2,28.15
GNDA  (via drill 0.3, 0.35)
  Top 0.152: v18.9,80.18 19.13,79.95 U1.24
  Top 0.3: U18.11 25.89,64.65 26.53,64.01 26.53,61.59 25.13,60.19 24.5,60.19 v24.45,60.24 24.26,60.05 19.78,60.05 19.2,60.63 18,60.63 | v17.55,67.1 19.02,68.58 v19.02,70.4 | 18,60.63 16.67,60.63 14.7,62.6 v14.4,62.6 | C26.2 18,60.75 18,60.63
  Top 0.4: U7.5 10.57,27.5 v9.9,27.5 | U6.5 10.58,46.33 v10.2,45.95
  Top 0.5: v10.35,60.35 10.29,60.29 U25.1
  Bottom 0.2: 12.3,30.05 12.1,30.05 C42.2 | 12.3,30.05 12.95,30.05 C40.2 | C23.1 12.3,27.75 12.3,30.05 | C28.2 23.45,57.35 24.1,58 R24.1 24.1,59.89 v24.45,60.24
  Bottom 0.25: 23.4,56.65 C28.2
  Bottom 0.3: v18.9,80.18 18.9,78.65 C2.1 19.02,78.35 v19.02,70.4 | 10.72,46 10.57,46 10.25,46 v10.2,45.95 | R31.1 18,66.65 v17.55,67.1 17.55,66.85 16.94,66.24 16.94,66.25 R18.1 15.7,65.25 15.7,63.35 14.95,62.6 v14.4,62.6
  Bottom 0.4: C23.1 10.15,27.25 v9.9,27.5 9.9,28 10.08,28.18 10.08,33 10.72,33.64 10.72,46 | 11.11,50.25 11.11,47.16 10.57,46.62 10.57,46 | 11.11,50.25 C43.2 | 11.11,50.25 C24.2 10.41,50.79 10.41,52.91 12.15,54.65 13.8,54.65 C25.2
  Bottom 0.5: v10.35,60.35 10.95,60.95 11,60.95 | 11,60.95 12.6,60.95 | 12.6,60.95 13.2,60.95 13.62,61.38 | 13.62,61.38 14.4,62.15 v14.4,62.6 | C25.2 13.8,57.48 12.6,58.68 12.6,60.95 | R47.1 11.45,61.4 11,60.95 | C41.2 14.18,61.38 13.62,61.38
GNDI  (via drill 0.35)
  Top 0.2: U3.9 35,30.84 | U4.9 35,41.28 35.36,41.64 | U5.4 35.78,52 35,51.22 U5.9
  Top 0.3: U4.4 35.73,42 35.36,41.64
  other vias: 18.5,45.5 17.5,45.5 16.5,45.5 16.5,44.5 17.5,44.5 19.5,44.5 18.5,44.5 17.5,46.5 20.5,44.5 18.5,46.5 19.5,35.5 18.5,35.5 17.5,35.5 16.5,35.5 16.5,34.5 17.5,34.5 19.5,34.5 18.5,34.5 17.5,36.5 18.5,36.5 20.5,34.5 20.5,35.5 21.5,35.5 21.5,34.5 19.5,25.5 18.5,25.5 17.5,25.5 16.5,25.5 16.5,24.5 17.5,24.5 19.5,24.5 18.5,24.5 15.53,24.5 17.5,26.5 18.5,26.5 15.53,25.5 20.5,24.5 20.5,25.5 21.5,25.5 21.5,24.5 19,13 17,13 19,15.7 18,15.7 17,15.7 16,15.7 17.5,16.5 18.5,16.5 19,14 17,14 18,14 18,13 25,2 23,2 21,2 19,2 17,2 41,2 39,2 37,2 35,2 33,2 31,2 43,2 34.05,44.7 33.05,45.7 34.05,45.7 33.05,44.7 30.05,46.7 31.05,46.7 31.05,45.7 30.05,45.7 34,35 34,36 33,37 30,37 34,37 33,35 33,36 30,36 31,36 35.35,17.65 29.65,16.8 44,36 44,35 44,33 43,32 43,33 43,35 43,36 44.25,19.25 44.25,20.25 44.25,21.25 44.25,22.25 56,36 57,36 57,35 56,35 56,38 57,38 57,37 56,37 56,30 56,28 56,26 56,24 56,22 35.7,33.2 35.2,30.9 34.8,40.8
  pour Top (no thermals): 16.15,44.5 19.5,44.5 19.5,47.7 16.15,47.7
  pour Top (no thermals): 16.15,34.5 19.5,34.5 19.5,37.8 16.15,37.8
  pour Top (no thermals): 16.15,24.5 19.5,24.5 19.5,27.7 16.15,27.7
  pour Top (no thermals): 16.15,15.5 19.5,15.5 19.5,17.7 16.15,17.7
  pour Top (no thermals): 53.42,15.1 49.42,15.1 49.42,11.1 53.42,11.1
  pour Bottom (no thermals): 53.42,15.1 49.42,15.1 49.42,11.1 53.42,11.1
  pour Bottom (no thermals): 53.45,40.03 49.45,40.03 49.45,36.03 53.45,36.03
  pour Top (isolate 0.5, no thermals): 53.45,40.03 49.45,40.03 49.45,36.03 53.45,36.03
  pour Bottom (isolate 0.305, rank 3): 0,-1 0,49 15,49 15,54.05 37,54.05 37,43 40,40 60,40 60,-1
  pour Top (isolate 0.305, rank 3): 0,-1 0,49.75 37,49.75 37,48.1 44.55,40.55 60,40.55 60,-1
  pour Top: 33,52.85 38.9,52.85 38.9,45.1 33,45.1
  pour Top (no thermals): 41,14.47 43,14.47 43,11 41,11
  pour Top (no thermals): 17,9.78 20.45,9.78 20.45,4 17,4
  pour Bottom (no thermals): 17,9.78 20.45,9.78 20.45,4 17,4
GPIO0
  Top 0.152: JP8.1 42.28,81.15 U1.70
GPIO1
  Top 0.152: JP8.2 40.14,81.55 U1.71
GPIO2
  Top 0.152: JP8.3 42.4,83.81 36.93,83.81 36.09,82.97 35.66,82.97 35.44,82.75 U1.74
GPIO3
  Top 0.152: JP8.4 37.53,84.95 35.95,83.36 35.28,83.36 35.07,83.15 U1.75
GPIO4
  Top 0.152: JP8.5 42.27,86.22 38.24,86.22 35.77,83.75 34.9,83.75 34.7,83.55 U1.76
GPIO5
  Top 0.152: JP8.6 38.93,87.5 35.55,84.12 U1.1
GPIO6
  Top 0.152: JP8.7 42.4,88.89 39.13,88.89 36.02,85.78 32.68,85.78 32.02,85.12 U1.4
GPIO7
  Top 0.152: JP8.8 39.72,90.03 35.84,86.16 32.55,86.16 31.62,85.22 U1.5
HALL_UX
  Top 0.152: U1.38 26.57,74.35 26.29,74.07 18.73,74.07 16.64,71.98 16.59,71.98 16,71.4 U19.12
HALL_UX_5V  (via drill 0.3)
  Top 0.2: U19.13 16.65,70.09 15.26,68.7 13.2,68.7 13.1,68.6 v13.1,68.35
  Bottom 0.2: R40.1 C29.2 9.55,64 10.4,64.85 10.4,66.7 11.45,67.75 12.5,67.75 v13.1,68.35
HALL_V
  Top 0.152: U1.37 26.46,74.75 26.14,74.43 18.58,74.43 16.55,72.4 15.54,72.4 14.7,71.56 U19.10
HALL_V_5V  (via drill 0.3)
  Top 0.2: U19.11 15.35,70.18 14.42,69.25 12.45,69.25 v11.85,68.65
  Bottom 0.2: R41.1 C30.2 9.5,68.65 v11.85,68.65
HALL_WY
  Top 0.152: U1.36 26.36,75.15 26,74.78 18.43,74.78 16.4,72.75 14.89,72.75 13.4,71.26 U19.8
HALL_WY_5V  (via drill 0.3)
  Top 0.2: U19.9 14.05,70.05 13.8,69.8 12.3,69.8 v12.15,69.95
  Bottom 0.2: C31.2 R42.1 11.8,70.3 v12.15,69.95
INPUT_GATE  (via drill 0.35)
  Top 0.5: v31.25,15.42 31.2,15.38 U22.4
  Bottom 0.5: U20.5 29.52,15.03 29.88,15.38 31.2,15.38 v31.25,15.42
MISO
  Top 0.152: X1.6 arc45 25.1,103.64 25.1,102.32 arc50 29.01,92.89 arc-45 30.02,90.45 U1.9
MOSI
  Top 0.152: U1.8 30.42,91.02 arc45 29.55,93.12 28.27,94.4 arc-30 25.8,100.35 arc-90 26.05,100.59 26.24,100.59 arc90 26.57,100.92 26.57,100.92 arc90 26.24,101.25 26.05,101.25 arc-90 25.71,101.58 25.71,101.58 arc-90 26.05,101.91 26.24,101.91 arc90 26.57,102.24 26.57,102.24 arc90 26.24,102.57 26.05,102.57 arc-90 25.71,102.9 25.71,103.25 X1.5
MOT_A  (via drill 0.35)
  Top 0.152: 21.69,49.97 v21.65,49.92
  Top 0.2: U8.3 21.69,49.97
  Top 0.254: v21.65,49.92 21.1,49.92 v20.8,49.62 | U5.6 31.97,51.2 31.84,51.08 v31.69,51.08
  Bottom 0.152: C22.2 31.69,51.88 v31.69,51.08
  Bottom 0.2: 22,49.75 21.82,49.92 v21.65,49.92
  Bottom 0.254: v20.8,49.62 20.93,49.75 22,49.75 23.98,49.75 D6.A 24.15,49.92 27.18,49.92 29.3,52.05 31.43,52.05 31.69,51.78 v31.69,51.08
  pour Top (isolate 0.305, no thermals): 22.8,52.9 22.8,49.3 21.5,49.3 20.75,48.55 15.85,48.55 15.85,52.9
  pour Top (isolate 0.305, no thermals): 12.9,53.02 12.9,51.1 15.75,48.25 20.35,48.25 20.35,49.45 16.77,53.02
MOT_A_OUT
  pour Top (isolate 0.305, no thermals): 5,48.48 5,44 5.45,43.55 9,43.55 9,47.1 11.85,49.95 12.18,49.95 12.18,53.08 9.6,53.08
MOT_B  (via drill 0.35)
  Top 0.152: U10.3 21.84,39.97 v21.77,39.9
  Top 0.254: v20.48,39.62 21.66,39.62 22,39.97 U10.3 | U4.6 31.97,41.2 31.84,41.08 v31.69,41.08
  Bottom 0.152: C21.2 31.69,41.88 v31.69,41.08
  Bottom 0.2: v21.77,39.9 22,39.67 22,39.62
  Bottom 0.254: v31.69,41.08 31.69,41.78 31.43,42.05 28.35,42.05 26,39.7 D7.A 23.93,39.62 22,39.62 v20.48,39.62
  pour Top (isolate 0.305, no thermals): 22.8,43.2 22.8,39.33 21.32,39.33 20.2,38.2 16.02,38.2 16.02,43.2
  pour Top (isolate 0.305, no thermals): 5,38 5,36.58 5.58,36 8.9,36 11.5,38.6 20,38.6 20,43 12.25,43 9.7,40.45 7.45,40.45
MOT_C  (via drill 0.35)
  Top 0.254: v20.1,29.62 20.44,29.97 v21.82,29.97 U12.3 | U3.6 31.97,31.2 31.84,31.08 v31.69,31.08
  Bottom 0.152: C20.2 31.69,31.88 v31.69,31.08
  Bottom 0.2: 22,29.78 21.82,29.95 v21.82,29.97
  Bottom 0.254: v20.1,29.62 20.25,29.78 22,29.78 D8.A 26.68,29.78 29.1,32.2 31.27,32.2 31.69,31.78 v31.69,31.08
  pour Top (isolate 0.305, no thermals): 22.77,33.38 22.77,29.3 21.3,29.3 20.2,28.2 16.15,28.2 16.15,33.38
  pour Top (isolate 0.305, no thermals): 12.97,33.85 15.35,33.85 15.88,33.33 16.32,33.33 16.52,33.12 17.45,33.12 17.45,29.53 13.97,29.53 12.97,30.53
MOT_C_OUT
  pour Top (isolate 0.305, no thermals): 12.22,33.78 12.22,31.03 9.55,28.35 5.6,28.35 5,28.95 5,30 6.75,31.75 7.97,31.75 9.81,33.78
MOT_D  (via drill 0.35)
  Top 0.254: v20.07,19.17 20.61,19.72 v21.27,19.72 21.95,19.72 U15.3 | U2.6 31.97,21.2 31.84,21.08 v31.69,21.08
  Bottom 0.152: C19.2 31.69,21.88 v31.69,21.08
  Bottom 0.2: 22,19.42 21.71,19.72 v21.27,19.72
  Bottom 0.254: v20.07,19.17 20.32,19.42 22,19.42 D11.A 25.75,19.42 28.5,22.17 31.3,22.17 31.69,21.78 v31.69,21.08
  pour Top (isolate 0.305, no thermals): 22.8,23.2 22.8,19.38 21.52,19.38 20.6,18.45 16.05,18.45 16.05,23.2
  pour Top (isolate 0.305, no thermals): 21,19 6,19 5,20 5,22.5 5.75,23.25 21,23.25
N$1
  Top 0.2: R36.1 7.15,68.95 7.15,67 4.11,63.96 JP12.4
  Bottom 0.2: R40.2 5.29,63.96 JP12.4
N$3
  Top 0.2: R38.1 5.4,69.3 5.4,67.7 4.2,66.5 JP12.3
  Bottom 0.2: R41.2 3.4,66.1 JP12.3
N$4  (via drill 0.3)
  Top 0.152: v28.5,87.3 28.82,86.98 U1.12
  Top 0.2: D1.A 34.9,87.65 v34.98,87.58
  Bottom 0.2: v34.98,87.58 34.04,86.64 29.16,86.64 v28.5,87.3
N$5  (via drill 0.3)
  Top 0.2: v44.15,54.67 44.15,55.52 U24.3 42.27,55.83 R45.1
  Bottom 0.2: R46.2 44.15,54.92 v44.15,54.67
N$6  (via drill 0.35)
  Top 0.2: U23.4 55.87,49 v57,49
  Bottom 0.2: R49.2 R1.1 56.25,49 v57,49
N$7
  Bottom 1: SJ7.2 H1.B3,0
N$8
  Top 0.3: LED1.A 52.77,66.65 R29.1
N$9
  Top 1: X1.2 20.76,106.62 14.35,106.62 JP5.2
N$10
  Bottom 1: SJ8.2 H2.B3,0
N$12
  Top 0.75: U24.1 44.45,58.77 43.17,60.05 43.17,60.77 L2.2
  Top 1: L2.2 41.25,62.7 40.51,62.7 D16.A
N$13
  Top 0.254: U5.5 31.52,52 R11.2
  Top 0.3: R11.2 31.52,53.92 D17.C
N$15  (via drill 0.3)
  Top 0.2: R39.1 6.2,72.2 6.2,71.9 | v6.2,71.7 6.2,71.9 | 6.2,71.9 3.34,69.04 JP12.2
  Bottom 0.2: R42.2 6.35,71.3 6.35,71.55 v6.2,71.7
N$16  (via drill 0.35)
  Top 0.2: v48.9,44.4 48.8,44.5 46.2,44.5 45.9,44.8
  Top 0.5: D14.C 45.59,45.62 L1.1 | 49.2,44.87 49.23,44.89 U23.8 49.75,44.52 50.35,43.92 v50.35,43.47
  Top 0.8: L1.1 45.95,45.62 46.7,44.87
  Top 1: 49.2,44.87 46.7,44.87
  Bottom 0.2: C36.2 51,42.83 v50.35,43.47 | D15.C 49.15,44.15
  Bottom 0.4: D15.C 49.15,42.28 v50.35,43.47
  Bottom 0.5: 49.15,44.15 v48.9,44.4
N$17
  Top 0.2: X1.16 38.89,106.11 40.35,104.65 40.35,102.35 39.05,101.05 R22.2
N$18  (via drill 0.35)
  Top 0.254: v32.85,48.75 32.85,49.6 U5.8
  Bottom 0.152: C22.1 33.33,52.05
  Bottom 0.25: v32.85,48.75 33.15,48.75 33.7,49.3 D5.C
  Bottom 0.254: 33.33,52.05 33.52,51.85 33.52,49.64 D5.C
N$19  (via drill 0.35)
  Top 0.2: U23.1 56.16,44.89
  Top 0.254: v56.48,43.83 56.48,44.58 56.16,44.89
  Bottom 0.254: v56.48,43.83 55.58,43.83 54.58,42.83 C36.1
N$20
  Top 0.5: SJ6.1 22.38,99.66 22.38,104.47 23.65,105.75 X1.4
N$21  (via drill 0.35)
  Top 0.254: v49.65,50.02 49.65,49.18 U23.5
  Bottom 0.254: v49.65,50.02 50.25,49.42 R43.1 50.45,48.75
  Bottom 0.3: R44.1 R43.1
N$24
  Bottom 0.152: C33.1 25.25,12.05
  Bottom 0.5: U20.1 25.55,14.08 25.55,12.35 25.25,12.05
N$25  (via drill 0.35)
  Top 0.2: 55.62,46.12 U23.2
  Top 0.254: U23.2 56.59,46.16 v57.48,45.28
  Bottom 0.254: C35.2 54.6,44.9 55.02,45.33 57.42,45.33 v57.48,45.28
N$27
  Top 0.254: U5.7 32.2,50.4 R10.2
  Top 0.3: R10.2 31.52,48.17 D22.C
N$28  (via drill 0.35)
  Top 0.254: U4.8 32.85,39.39 v32.85,38.75
  Bottom 0.152: C21.1 33.33,42.05
  Bottom 0.2: D4.C 33.45,39.3
  Bottom 0.254: 33.6,39.3 33.05,38.75 v32.85,38.75
  Bottom 0.3: 33.33,42.05 33.45,41.92 33.45,39.3 | 33.6,39.3 D4.C
N$29
  Top 0.254: U4.5 31.52,42 R9.2
  Top 0.3: D18.C 31.7,42.6 R9.2
N$30
  Top 0.254: U4.7 32.2,40.4 R8.2
  Top 0.3: R8.2 31.52,38.12 D21.C
N$31  (via drill 0.35)
  Top 0.254: v32.85,18.95 32.85,19.6 U2.8
  Bottom 0.152: C19.1 33.33,22.05
  Bottom 0.254: v32.85,18.95 33.2,19.3 D2.C
  Bottom 0.3: 33.33,22.05 33.55,21.83 33.55,19.3 D2.C
N$32
  Top 0.254: U2.5 31.52,22 R5.2
  Top 0.3: R5.2 31.52,23.92 D20.C
N$33
  Top 0.254: U2.7 32.2,20.4 R4.2
  Top 0.3: D24.C 31.6,19.65 R4.2
N$34  (via drill 0.35)
  Top 0.254: v32.75,28.65 32.75,29.6 U3.8
  Bottom 0.152: C20.1 33.33,32.05
  Bottom 0.254: v32.75,28.65 33.4,29.3 D3.C
  Bottom 0.3: 33.33,32.05 33.48,31.9 33.48,29.3 D3.C
N$35
  Top 0.254: U3.5 31.52,32 R7.2
  Top 0.3: D19.C 31.7,32.6 R7.2
N$36
  Top 0.254: U3.7 32.2,30.4 R6.2
  Top 0.3: R6.2 31.5,29.7 D23.C
PWM_I
  Top 0.152: JP10.1 55.86,75.9 46.7,75.9 46.25,76.35 U1.58
REF_H
  Top 0.152: JP9.3 56.23,84.27 56.23,86.24 55.31,87.16 52.57,87.16 45.76,80.35 U1.68
REF_L
  Top 0.152: JP9.1 55.8,82.15 55.8,86.16 55.16,86.81 52.76,86.81 45.9,79.95 U1.67
REF_R
  Top 0.152: JP9.5 55.52,87.52 52.31,87.52 45.54,80.75 U1.69
RES_FET  (via drill 0.35)
  Top 0.254: v39,15 37.83,13.83 U17.5
  Bottom 0.254: D12.A 41,15.22
  Bottom 0.305: 41,15.22 39.23,15.22 v39,15
  Bottom 1: D13.C 42.21,8.95 41.43,8.17 X2.4
  pour Top (isolate 0.305, no thermals): 42.5,9 42.5,5.5 42,5 41.02,5 35.75,10.28 35.75,15.58 40,15.58 40,11 42,9
RESET  (via drill 0.3)
  Top 0.152: U1.50 32.4,73.75 32.4,69.17 v32.66,68.91
  Top 0.2: X1.3 23.32,103.41 23.32,90.05 v23.3,90.03 | v20.32,72.1 20.5,72.1 20.5,68.9 v20.4,68.9
  Bottom 0.152: R2.1 28.38,68.9 v20.4,68.9
  Bottom 0.2: v32.66,68.91 32.34,69.22 28.7,69.22 R2.1 | v20.32,72.1 20.32,72.7 21.07,73.45 21.07,84.5 21.4,84.83 21.4,88.2 23.23,90.03 v23.3,90.03
SCK
  Top 0.152: U1.7 30.82,90.99 arc45 29.7,93.7 29.36,94.04 arc-45 27.57,98.34 27.57,105.04 arc-45 27.79,105.55 28.5,106.27 X1.8
SENSE_A  (via drill 0.3)
  Top 0.152: v25.2,84.95 25.2,84.59 26.64,83.15 U1.16
  Top 0.2: v23.94,71.62 23.85,71.53 23.85,62.71 23.74,62.6 23.74,61.1 v23.59,60.95
  Bottom 0.2: v25.2,84.95 25.2,84.8 24.05,83.65 24.05,72.72 23.89,72.57 23.89,72.03 23.94,71.98 v23.94,71.62 | 23,54.9 C28.1 22.56,54.9 | 22.56,54.9 21.65,54.9 R50.1 | v23.59,60.95 22.56,59.92 22.56,54.9
SENSE_A_RAW  (via drill 0.3, 0.35)
  Top 0.2: U6.7 13.13,47.53 v13.35,47.75 | v17.45,55.5 17.75,55.8 19.64,55.8 v19.8,55.64
  Bottom 0.2: 13.5,47.9 v13.35,47.75 14.1,48.5 14.1,51.7 17.45,55.05 v17.45,55.5 | R50.2 19.8,55 v19.8,55.64
SENSE_C  (via drill 0.3)
  Top 0.152: U1.18 25.9,82.35 24.45,83.8 23.84,83.8 v23.11,84.53
  Top 0.2: v21.09,60.8 22.63,62.34 v22.63,71.3
  Bottom 0.2: v22.63,71.3 22.58,71.35 22.58,72.47 23.11,73 v23.11,84.53 | C40.1 13.35,32.35 12.6,33.1 12.6,34.95 13.25,35.6 R51.1 13.03,36.12 13,36.1 13,45.75 15.15,47.9 15.15,51.28 18.68,54.81 18.68,56.46 20.19,57.97 20.19,59.3 21.09,60.2 v21.09,60.8
SENSE_C_RAW  (via drill 0.35)
  Top 0.2: v13.2,29.15 13.19,29.14 U7.7
  Bottom 0.2: v13.2,29.15 13.5,29.45 14.1,29.45 14.4,29.75 14.4,33.4 13.9,33.9 R51.2
STEP
  Top 0.152: JP10.2 56,75.5 46.55,75.5 46.1,75.95 U1.57
TH_FET  (via drill 0.3)
  Top 0.2: U18.3 v21,65.3
  Bottom 0.2: R30.1 26.8,33.35 34.5,33.35 36.05,34.9 36.05,52.95 34.24,54.76 28.36,54.76 28,55.13 28,59.35 22.65,64.7 21.6,64.7 v21,65.3 21,66.45 R31.2
UART_RX  (via drill 0.3)
  Top 0.152: U1.10 29.62,90.12 arc45 28.84,92.01 26.65,94.2 v25.15,94.2
  Top 0.2: JP6.1 56.38,97.92 v45.12,97.92
  Bottom 0.2: v25.15,94.2 28.88,97.92 v45.12,97.92
UART_TX  (via drill 0.3)
  Top 0.152: U1.11 29.22,89.89 arc45 28.55,91.5 26.85,93.2 v25.15,93.2
  Top 0.2: JP6.2 54.77,97 v44,97
  Bottom 0.2: v44,97 43.77,97.23 29.18,97.23 v25.15,93.2
V+  (via drill 0.35)
  Top 0.254: U23.7 50.06,46.1 v49.2,46.1
  Top 0.5: v27.88,16.7 27.8,16.62 27.8,14.85 U22.5
  Top 0.8: C10.+ 54.12,33.06 54.12,39.12 52.12,41.12 52.12,45.09 51.05,46.16 U23.7
  Bottom 0.2: R25.2 48,69.03 | 24.4,52.08 C11.1 | C37.2 46.33,46 | v49.2,46.1 49.05,46.25 49.05,46.36 48.6,46.81 48.6,49.75 48,50.35 R25.2 | 47.85,68.9 R25.2
  Bottom 0.254: v49.2,46.1 50.15,47.05 R43.2
  Bottom 0.3: C11.1 25,52.62 25,53.8 R23.2
  Bottom 0.305: v41.17,23.97 41.17,18.96 D12.C
  Bottom 0.5: v27.88,16.7 U20.4 | C37.2 49.1,46 v49.2,46.1
  other vias: 24.9,22.15 24.9,21.35 24.88,32.42 24.88,31.62 24.9,42.25 24.9,41.45 24.93,52.45 24.93,51.65
  pour Bottom (isolate 0.305, no thermals): 23.73,51.15 23.73,52.95 25.23,52.95 25.23,51.15
  pour Bottom (isolate 0.305, no thermals): 23.7,20.7 23.7,22.78 25.2,22.78 25.2,20.7
  pour Bottom (isolate 0.305, no thermals): 23.68,31.12 23.68,32.92 25.18,32.92 25.18,31.12
  pour Bottom (isolate 0.305, no thermals): 23.7,40.95 23.7,42.75 25.2,42.75 25.2,40.95
  pour Top (isolate 0.5, no thermals): 23.27,52.85 29,52.85 29,7 27,5 25.48,5 23.27,7.2
  pour Top (isolate 0.4, no thermals): 53.42,20.53 53.42,30.7 52.17,31.95 50.67,31.95 49.42,30.7 49.42,28.1 28,28.1 28,23.45 49.42,23.45 49.42,20.58 50.67,19.33 52.23,19.33
V_EXT  (via drill 0.3)
  Top 0.2: X1.13 36.35,103.22 37.1,102.47 37.1,92.92 37.92,92.1 45.9,92.1 v46.17,91.83
  Bottom 0.2: 45.73,73.28 45.5,73.05 45.45,73.05 | 45.73,73.28 46.4,73.95 46.4,91.6 v46.17,91.83 | R27.1 45.45,73.05 | 45.45,73.05 R28.2 45.58,73.28 45.73,73.28
V_GD  (via drill 0.35)
  Top 0.2: R45.2 41.83,57.27
  Top 0.254: U5.1 36.97,49.62 v38.17,49.62 38.08,49.62 | U4.1 v38.15,39.6 38.73,39.03 C7.2 | U3.1 v38.15,29.6 38.2,29.55 C6.2 | U2.1 v38.15,19.6 38.15,19.97 39.52,21.35 C5.2
  Top 0.3: U14.2 40.67,21.08 C5.2 | 38.17,47.9 C8.2 37.98,49.42 v38.17,49.62
  Top 0.4: C39.1 39.58,57.2 36.97,57.2 JP4.1
  Top 0.5: 41.83,57.27 40.5,58.6 | 40.5,58.6 40.5,58.12 C39.1 | 40.5,58.6 D16.C | U25.3 15.75,58.55 v15.9,58.7 16.04,58.84 31.2,58.84 32.19,59.83 35.92,59.83 36.6,59.15 36.57,59.12 JP4.1
  Bottom 0.2: 37.08,49.24 D5.A 37.46,49.62 v38.17,49.62
  Bottom 0.254: v38.15,39.6 38,39.45 37.29,39.45 D4.A | v38.15,29.6 37.85,29.3 D3.A | v38.15,19.6 37.85,19.3 D2.A
  Bottom 0.3: v38.17,49.62 37.39,49.62 37.02,50
  Bottom 0.5: C41.1 15.6,59 v15.9,58.7
  Bottom 1: D2.A 37.17,19.3 37.17,29.3 D3.A 37.14,29.6 37.14,29.61 D4.A 37.02,39.42 37.02,50 37.02,56.8 JP4.1
V_INT  (via drill 0.3)
  Top 0.2: X1.14 37.6,105.02 37.6,93 37.98,92.62 46.84,92.62 v46.93,92.53
  Bottom 0.2: v46.93,92.53 47.05,92.41 47.05,73.97 48,73.03 R26.2 R25.1
V_INT_TMC  (via drill 0.3)
  Top 0.152: v24.55,72.3 24.57,72.3 24.57,67.73 24.3,67.45 24.3,65.3 | U1.20 25.2,81.55 v24.93,81.83 | U18.12 24.3,65.3 | 24.3,65.3 24.3,63.65 24.6,63.35 U18.9 U18.8
  Bottom 0.152: v24.93,81.83 24.43,81.33 24.43,72.58 24.55,72.45 v24.55,72.3
V_INT_TMC_RAW  (via drill 0.3)
  Top 0.2: v24.55,61.15 24.95,61.15 25.95,62.15 25.95,63.95 25.9,64 U18.10
  Bottom 0.2: v24.55,61.15 25.6,60.1 25.6,59 | R23.1 25.6,59 | R24.2 25.6,59
V_MOT_IN  (via drill 0.35)
  Bottom 0.152: C33.2 27.15,12.05
  Bottom 0.2: U20.3 26.02,15.97 26.52,15.47 26.52,14.33 26.78,14.08 U20.6 | v30.43,13.83 30.89,14.29 31.38,14.29 33.94,16.85 37.74,16.85 40.05,19.16 40.05,21.37 40.28,21.6 40.28,27.71 41.4,28.83 41.4,38.62 42.45,39.67 42.45,66.05 R27.2
  Bottom 0.5: v30.43,13.83 30.18,14.08 U20.6 27.53,14.08 27.53,12.43 27.15,12.05
  other vias: 30.43,12.83 32.42,12.83 31.43,12.83 30.43,11.83 31.43,11.83 32.42,11.83 31.43,13.83
  pour Top (isolate 0.4, no thermals): 29.7,14.47 29.7,6.2 30.9,5 34.38,5 34.8,5.42 34.8,8.58 34,9.38 34,12.08 31.6,14.47
  pour Bottom (isolate 0.4, no thermals): 29.7,14.47 29.7,6.2 30.9,5 34.38,5 34.8,5.42 34.8,11.28 31.6,14.47
VCORE  (via drill 0.3)
  Top 0.152: v30.15,71.68 30.15,71.76 30.42,72.02 U1.45 | U1.15 27.04,83.55 26.87,83.72 v26.87,84.9 | v35.48,78.1 35.23,78.35 U1.63
  Bottom 0.152: C3.2 26.87,84.38 v26.87,84.9 | v35.48,78.1 35.48,78.67 C4.2
  Bottom 0.2: v30.15,71.68 30.15,71.75 C1.2 30.93,72.78 30.3,73.4 30.3,75.85 29.4,76.75 27.43,76.75 26.77,77.4 26.77,83.3 27.07,83.6 C3.2 30.77,80.47 34.08,80.47 35.02,79.53 C4.2
VREF_A_RAW  (via drill 0.35)
  Top 0.2: U6.6 11.87,47.47 v12,47.6
  Bottom 0.2: v12,47.6 12.15,47.75 C43.1 12.65,48.55 13.2,49.1 13.2,50.9 13.1,51 JP14.1
VREF_C_RAW  (via drill 0.35)
  Top 0.2: v11.55,29.11 11.72,28.94 11.72,27.62 U7.6
  Bottom 0.2: C42.1 11.5,32.23 10.7,31.43 10.7,29.77 11.36,29.11 v11.55,29.11
  Bottom 0.25: C42.1 11.5,37 JP13.1

## Text on the board
tPlace: E-Stop | EN | GND | 5V | 3V3 | P | N | 2.5V -> N / (Single ended) | V | AENC | RX | U|X | TX | W|Y | GND | 5V | 7 | 6 | UART (3V3) | 3V3 | 2V5 / N Offset | GND | 4 | 5 | 5V | R | GPIO | 3 | 2 | Z | AGPI_A | Z | 0 | B | H | ENC | 1 | ENO | L | B | ENC2 (3V3) | A | TMC4671 | A | PWM | GND | STP | 5V | DIR | WY | PWR | V | HALL | UX | GND | + | 5V | 10V | A | MOTOR | B | C | D | 3 phase / ABC = UVW | MOTOR / A|B|C|D | GND | PB+ | VM | PB- | Power | SUPPLY / 1:GND / 2:PB+ / 3:VM + / 4:PB-
bPlace: 5V | E-Stop | 16 | 2 | 1 | GND | 5V | RST | 3V3 | MOSI | MISO | CS1 | SCK | CS2 | CS3 | FLAG | BRK | V_EXT | V_INT | NC | ENABLE | EN | GND | P | N | V | RX | UART | U | TX | Cos | 1 | 2 | 3 | AENC | GND | W | Sin | N/CM | 2V5 | 3V3 | 5V | N Offset | SPI ADDR | 5V | GND | ENC2 (3V3) | Z | R | 5V | B | H | Z | A | L | B | PWM | A | ENCODER | VEXT | VINT | STP | GND | DIR | 5V | WY | V | HALL | BR_TH | 2V5-REF / Sense | UX | GND | 5V | V_GD / (10V) | STEPPER: AB(A) CD(B) | 3 PHASE: ABC(UVW) | DC: AB | Open FFBoard - TMC4671 Motor driver | A | MOTOR | B | TMP | C | GIT version / V1.3.3 - YR 2023 / ACS724 30 (66mV/A) | D | Supply: / PSU (protected): VM (+) and GND (-) / ALWAYS connect braking resistor / between PB+ and PB- | R | VM | GND | PB+ | PB- | - | + | Power